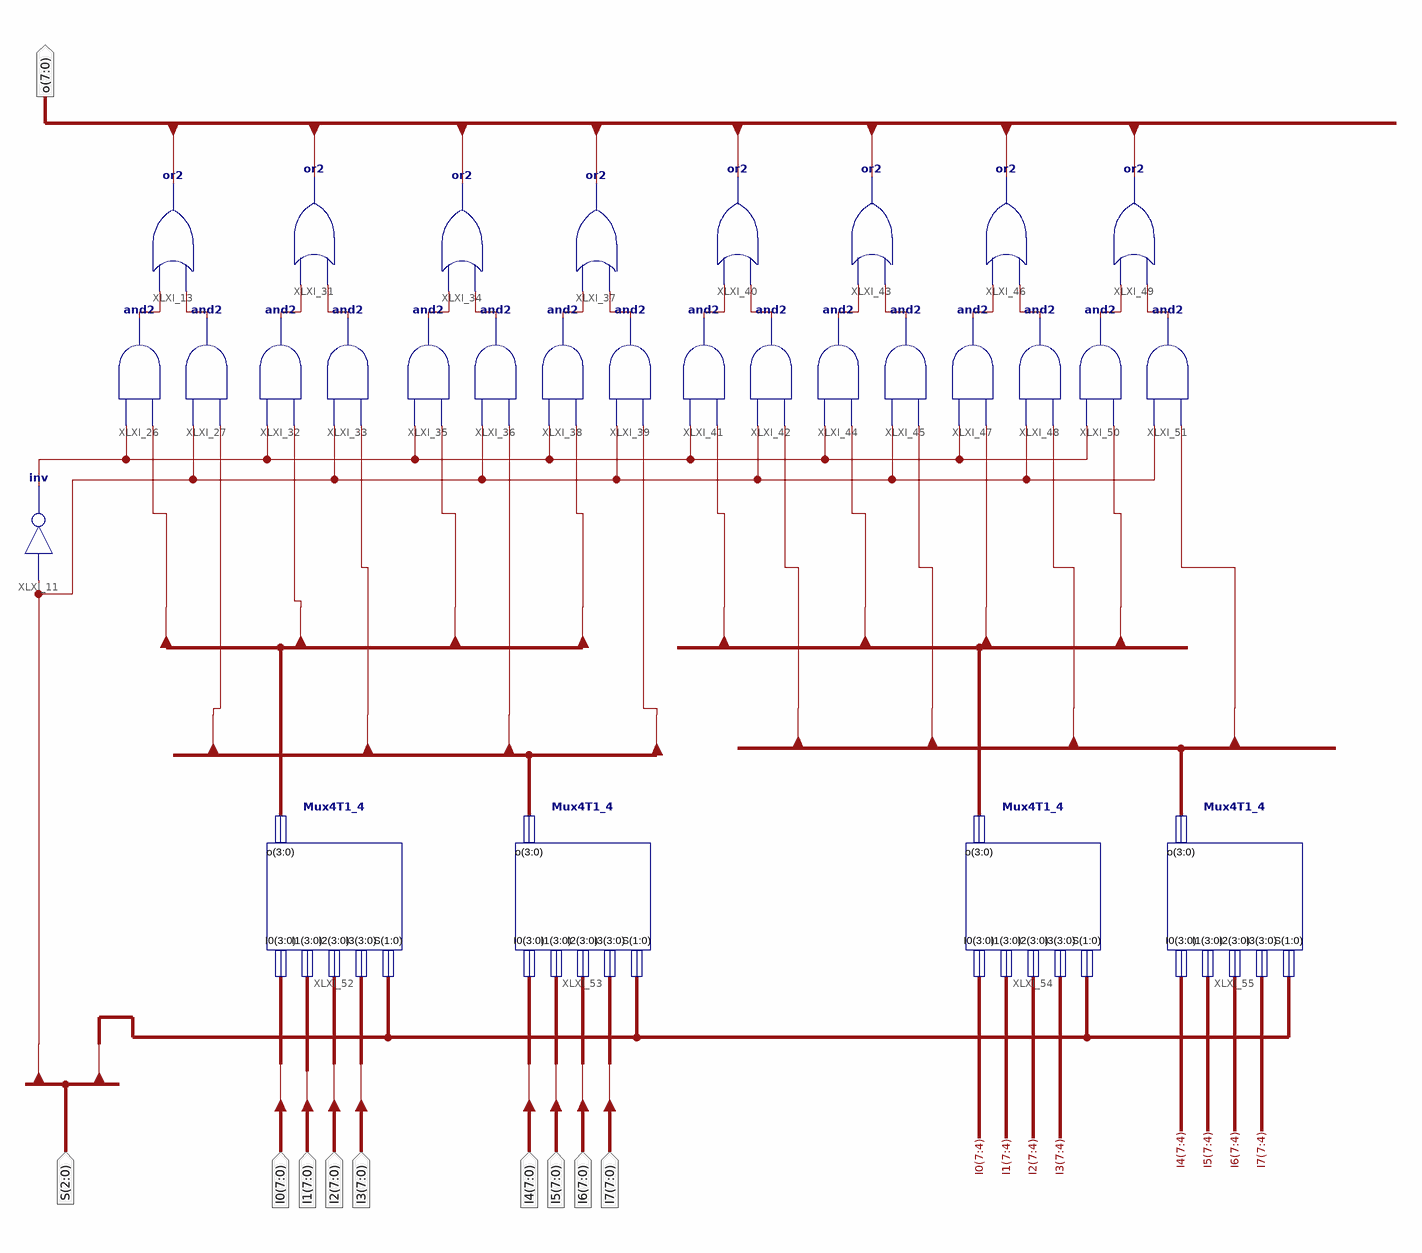
[diagram p0: schematic sheet 1]
// Xilinx ISE schematic MUX8T1_8.sch (kintex7) as structural Verilog: 29 symbols, 10 ports
module MUX8T1_8 (
  input  [7:0] I1,
  input  [7:0] I0,
  input  [7:0] I2,
  input  [7:0] I3,
  input  [7:0] I4,
  input  [7:0] I5,
  input  [7:0] I6,
  input  [7:0] I7,
  input  [2:0] S,
  output [7:0] o
);

  wire XLXN_95, XLXN_96, XLXN_101, XLXN_102, XLXN_104, XLXN_105, XLXN_107, XLXN_108, XLXN_110, XLXN_111,
       XLXN_113, XLXN_114, XLXN_116, XLXN_117, XLXN_119, XLXN_120, XLXN_124;
  wire [3:0] o0, o1, o2, o3;

  not XLXI_11 (XLXN_124, S[2]);
  or XLXI_13 (o[0], XLXN_96, XLXN_95);
  and XLXI_26 (XLXN_95, o0[0], XLXN_124);
  and XLXI_27 (XLXN_96, o1[0], S[2]);
  and XLXI_32 (XLXN_101, o0[1], XLXN_124);
  and XLXI_33 (XLXN_102, o1[1], S[2]);
  or XLXI_34 (o[2], XLXN_105, XLXN_104);
  and XLXI_35 (XLXN_104, o0[2], XLXN_124);
  and XLXI_36 (XLXN_105, o1[2], S[2]);
  or XLXI_37 (o[3], XLXN_108, XLXN_107);
  and XLXI_38 (XLXN_107, o0[3], XLXN_124);
  and XLXI_39 (XLXN_108, o1[3], S[2]);
  or XLXI_40 (o[4], XLXN_111, XLXN_110);
  and XLXI_41 (XLXN_110, o2[0], XLXN_124);
  and XLXI_42 (XLXN_111, o3[0], S[2]);
  and XLXI_44 (XLXN_113, o2[1], XLXN_124);
  and XLXI_45 (XLXN_114, o3[1], S[2]);
  or XLXI_46 (o[6], XLXN_117, XLXN_116);
  and XLXI_47 (XLXN_116, o2[2], XLXN_124);
  and XLXI_48 (XLXN_117, o3[2], S[2]);
  or XLXI_49 (o[7], XLXN_120, XLXN_119);
  and XLXI_50 (XLXN_119, o2[3], XLXN_124);
  and XLXI_51 (XLXN_120, o3[3], S[2]);
  or XLXI_31 (o[1], XLXN_102, XLXN_101);
  or XLXI_43 (o[5], XLXN_114, XLXN_113);
  Mux4T1_4 XLXI_52 (.I0(I0[3:0]), .I1(I1[3:0]), .I2(I2[3:0]), .I3(I3[3:0]), .S(S[1:0]), .o(o0));
  Mux4T1_4 XLXI_53 (.I0(I4[3:0]), .I1(I5[3:0]), .I2(I6[3:0]), .I3(I7[3:0]), .S(S[1:0]), .o(o1));
  Mux4T1_4 XLXI_54 (.I0(I0[7:4]), .I1(I1[7:4]), .I2(I2[7:4]), .I3(I3[7:4]), .S(S[1:0]), .o(o2));
  Mux4T1_4 XLXI_55 (.I0(I4[7:4]), .I1(I5[7:4]), .I2(I6[7:4]), .I3(I7[7:4]), .S(S[1:0]), .o(o3));
endmodule
